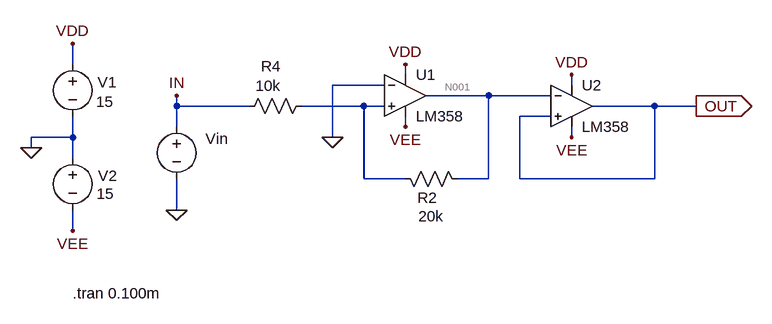
[diagram p0: schematic v1.0.asc]
* v1.0.asc
V1 VDD 0 15
Vin IN 0 SINE(0V 1V 10KH)
R2 N001 N002 20k
V2 0 VEE 15
* U1: LM358 (symbol MyLib\OpAmp\LM358 not available, pins judged from their places): In+=N002 In-=0 V+=VDD V-=VEE OUT=N001
R4 N002 IN 10k
* U2: LM358 (symbol MyLib\OpAmp\LM358 not available, pins judged from their places): In+=OUT In-=N001 V+=VDD V-=VEE OUT=OUT
.tran 0.100m
.backanno
.end

* Results of the author's LTspice run, read from the files saved beside the schematic
* Operating Point, zero values left out:
*   V(n001) = -200 µV
*   V(out) = -200 µV
*   V(vdd) = 15 V
*   V(vee) = -15 V
*   I(R2) = -10 nA
*   I(V1) = -688.2 µA
*   I(V2) = -688.2 µA
*   Ix(u1:1) = -10 nA
*   Ix(u1:2) = -10 nA
*   Ix(u1:3) = 20 nA
*   Ix(u1:4) = 344.1 µA
*   Ix(u1:5) = -344.1 µA
*   Ix(u2:1) = -10 nA
*   Ix(u2:2) = -10 nA
*   Ix(u2:3) = 10 nA
*   Ix(u2:4) = 344.1 µA
*   Ix(u2:5) = -344.1 µA
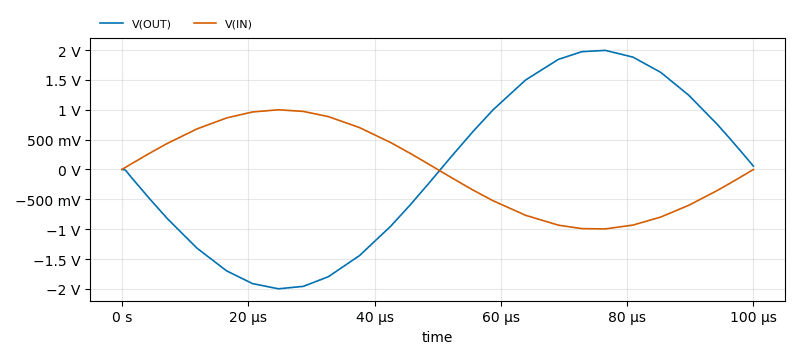
[diagram p1: Transient Analysis of v1.0.asc, plotted from the saved traces]
* Transient Analysis, 1 run:
*   V(OUT): min -1.998 V, max 1.995 V, average -387.6 µV, rms 1.412 V, last 55.5 mV
*   V(IN): min -995.3 mV, max 999.9 mV, average 43.8 µV, rms 705.8 mV, last 0 V